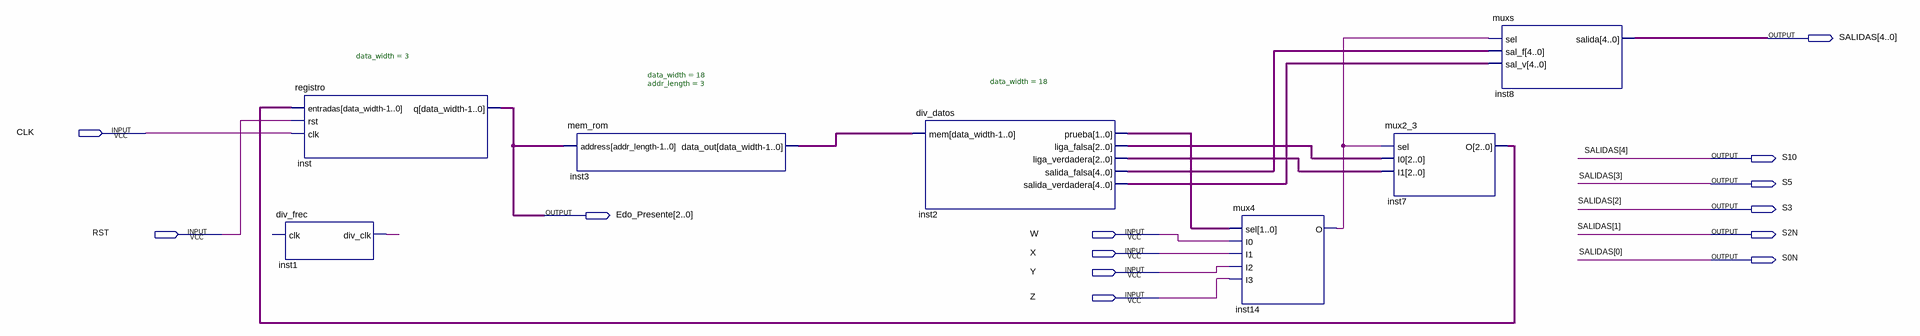
[diagram p0: schematic sheet]
// Quartus schematic practica4.bdf as structural Verilog: 7 symbols, 13 pins
module practica4 (
  input  CLK,
  input  RST,
  input  W,
  input  X,
  input  Y,
  input  Z,
  output [4:0] SALIDAS,
  output S10,
  output S5,
  output S3,
  output [2:0] Edo_Presente,
  output S2N,
  output S0N
);

  wire inst1_div_clk, inst14_o;
  wire [1:0] inst2_prueba;
  wire [2:0] inst2_liga_falsa, inst2_liga_verdadera, inst7_o;
  wire [4:0] inst2_salida_falsa, inst2_salida_verdadera;
  wire [17:0] inst3_data_out;

  registro #(.data_width(3)) inst (.entradas(inst7_o), .rst(RST), .clk(CLK), .q(Edo_Presente));
  div_frec inst1 (.div_clk(inst1_div_clk));  // open: clk
  mem_rom #(.data_width(18), .addr_length(3)) inst3 (.address(Edo_Presente), .data_out(inst3_data_out));
  div_datos #(.data_width(18)) inst2 (
    .mem(inst3_data_out), .prueba(inst2_prueba), .liga_falsa(inst2_liga_falsa),
    .liga_verdadera(inst2_liga_verdadera), .salida_falsa(inst2_salida_falsa),
    .salida_verdadera(inst2_salida_verdadera));
  mux4 inst14 (.sel(inst2_prueba), .I0(W), .I1(X), .I2(Y), .I3(Z), .O(inst14_o));
  mux2_3 inst7 (.sel(inst14_o), .I0(inst2_liga_falsa), .I1(inst2_liga_verdadera), .O(inst7_o));
  muxs inst8 (
    .sel(inst14_o), .sal_f(inst2_salida_falsa), .sal_v(inst2_salida_verdadera),
    .salida({S10, S5, S3, S2N, S0N}));

  assign SALIDAS = {S10, S5, S3, S2N, S0N};
endmodule
